# Altium schematic sheet gea24.SchDoc
size A; SheetNumber: 8; SheetTotal: 20
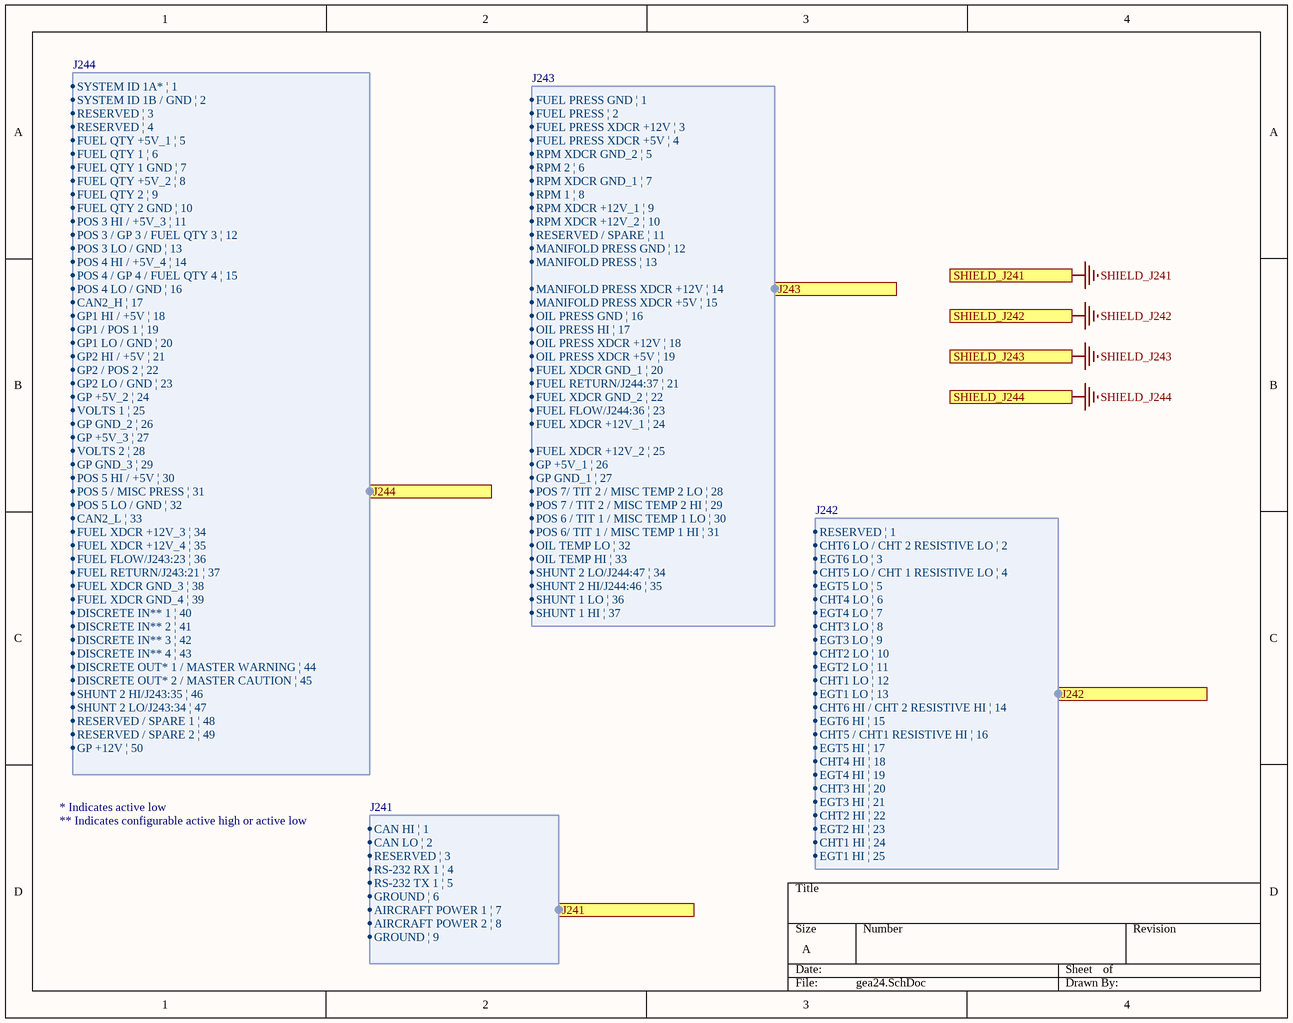
[diagram p0: gea24.SchDoc]

## Ports
J241 (harness J241), J242 (harness J242), J243 (harness J243), J244 (harness J244), SHIELD_J241, SHIELD_J242, SHIELD_J243, SHIELD_J244

## Harnesses
J241: CAN HI | 1, CAN LO | 2, RESERVED | 3, RS-232 RX 1 | 4, RS-232 TX 1 | 5, GROUND | 6, AIRCRAFT POWER 1 | 7, AIRCRAFT POWER 2 | 8, GROUND | 9
J242: RESERVED | 1, CHT6 LO / CHT 2 RESISTIVE LO | 2, EGT6 LO | 3, CHT5 LO / CHT 1 RESISTIVE LO | 4, EGT5 LO | 5, CHT4 LO | 6, EGT4 LO | 7, CHT3 LO | 8, EGT3 LO | 9, CHT2 LO | 10, EGT2 LO | 11, CHT1 LO | 12, EGT1 LO | 13, CHT6 HI / CHT 2 RESISTIVE HI | 14, EGT6 HI | 15, CHT5 / CHT1 RESISTIVE HI | 16, EGT5 HI | 17, CHT4 HI | 18, EGT4 HI | 19, CHT3 HI | 20, EGT3 HI | 21, CHT2 HI | 22, EGT2 HI | 23, CHT1 HI | 24, EGT1 HI | 25
J243: FUEL PRESS GND | 1, FUEL PRESS | 2, FUEL PRESS XDCR +12V | 3, FUEL PRESS XDCR +5V | 4, RPM XDCR GND_2 | 5, RPM 2 | 6, RPM XDCR GND_1 | 7, RPM 1 | 8, RPM XDCR +12V_1 | 9, RPM XDCR +12V_2 | 10, RESERVED / SPARE | 11, MANIFOLD PRESS GND | 12, MANIFOLD PRESS | 13, MANIFOLD PRESS XDCR +12V | 14, MANIFOLD PRESS XDCR +5V | 15, OIL PRESS GND | 16, OIL PRESS HI | 17, OIL PRESS XDCR +12V | 18, OIL PRESS XDCR +5V | 19, FUEL XDCR GND_1 | 20, FUEL RETURN/J244:37 | 21, FUEL XDCR GND_2 | 22, FUEL FLOW/J244:36 | 23, FUEL XDCR +12V_1 | 24, FUEL XDCR +12V_2 | 25, GP +5V_1 | 26, GP GND_1 | 27, POS 7/ TIT 2 / MISC TEMP 2 LO | 28, POS 7 / TIT 2 / MISC TEMP 2 HI | 29, POS 6 / TIT 1 / MISC TEMP 1 LO | 30, POS 6/ TIT 1 / MISC TEMP 1 HI | 31, OIL TEMP LO | 32, OIL TEMP HI | 33, SHUNT 2 LO/J244:47 | 34, SHUNT 2 HI/J244:46 | 35, SHUNT 1 LO | 36, SHUNT 1 HI | 37
J244: SYSTEM ID 1A* | 1, SYSTEM ID 1B / GND | 2, RESERVED | 3, RESERVED | 4, FUEL QTY +5V_1 | 5, FUEL QTY 1 | 6, FUEL QTY 1 GND | 7, FUEL QTY +5V_2 | 8, FUEL QTY 2 | 9, FUEL QTY 2 GND | 10, POS 3 HI / +5V_3 | 11, POS 3 / GP 3 / FUEL QTY 3 | 12, POS 3 LO / GND | 13, POS 4 HI / +5V_4 | 14, POS 4 / GP 4 / FUEL QTY 4 | 15, POS 4 LO / GND | 16, CAN2_H | 17, GP1 HI / +5V | 18, GP1 / POS 1 | 19, GP1 LO / GND | 20, GP2 HI / +5V | 21, GP2 / POS 2 | 22, GP2 LO / GND | 23, GP +5V_2 | 24, VOLTS 1 | 25, GP GND_2 | 26, GP +5V_3 | 27, VOLTS 2 | 28, GP GND_3 | 29, POS 5 HI / +5V | 30, POS 5 / MISC PRESS | 31, POS 5 LO / GND | 32, CAN2_L | 33, FUEL XDCR +12V_3 | 34, FUEL XDCR +12V_4 | 35, FUEL FLOW/J243:23 | 36, FUEL RETURN/J243:21 | 37, FUEL XDCR GND_3 | 38, FUEL XDCR GND_4 | 39, DISCRETE IN** 1 | 40, DISCRETE IN** 2 | 41, DISCRETE IN** 3 | 42, DISCRETE IN** 4 | 43, DISCRETE OUT* 1 / MASTER WARNING | 44, DISCRETE OUT* 2 / MASTER CAUTION | 45, SHUNT 2 HI/J243:35 | 46, SHUNT 2 LO/J243:34 | 47, RESERVED / SPARE 1 | 48, RESERVED / SPARE 2 | 49, GP +12V | 50

## Nets
SHIELD_J241: port SHIELD_J241
SHIELD_J242: port SHIELD_J242
SHIELD_J243: port SHIELD_J243
SHIELD_J244: port SHIELD_J244

## Notes on the sheet
- * Indicates active low
- ** Indicates configurable active high or active low